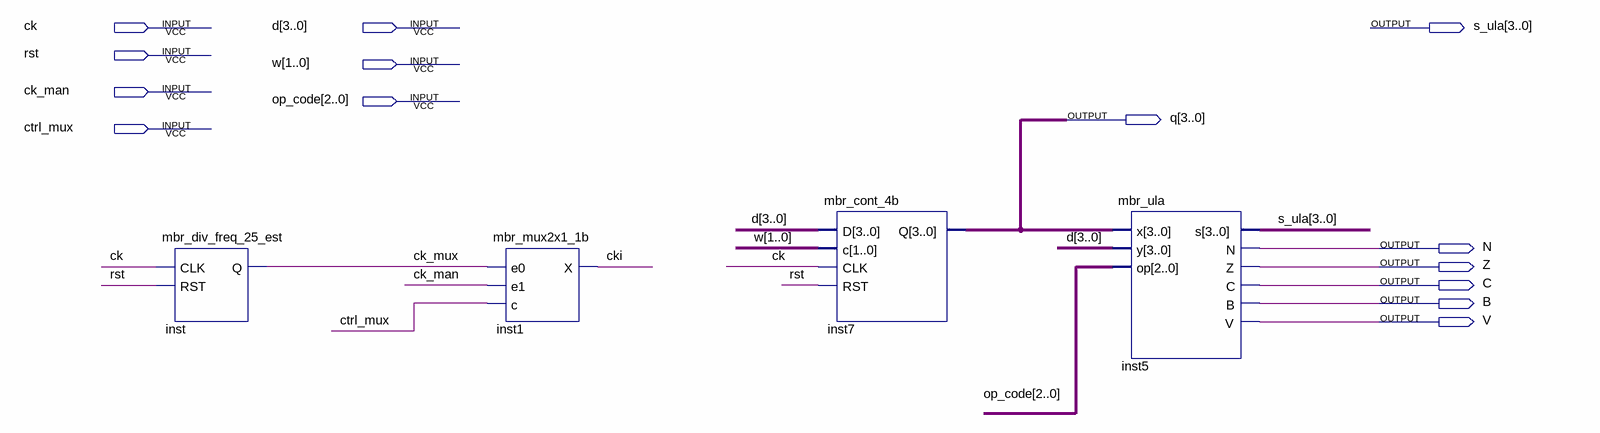
[diagram p0: schematic sheet]
// Quartus schematic projeto_final.bdf as structural Verilog: 4 symbols, 14 pins
module projeto_final (
  input  ck,
  input  [3:0] d,
  input  rst,
  input  [1:0] w,
  input  ck_man,
  input  [2:0] op_code,
  input  ctrl_mux,
  output [3:0] s_ula,
  output [3:0] q,
  output N,
  output Z,
  output C,
  output B,
  output V
);

  wire ck_mux, cki;

  mbr_div_freq_25_est inst (.CLK(ck), .RST(rst), .Q(ck_mux));
  mbr_mux2x1_1b inst1 (.e0(ck_mux), .e1(ck_man), .c(ctrl_mux), .X(cki));
  mbr_cont_4b inst7 (.D(d), .c(w), .CLK(ck), .RST(rst), .Q(q));
  mbr_ula inst5 (.x(q), .y(d), .op(op_code), .s(s_ula), .N(N), .Z(Z), .C(C), .B(B), .V(V));
endmodule
